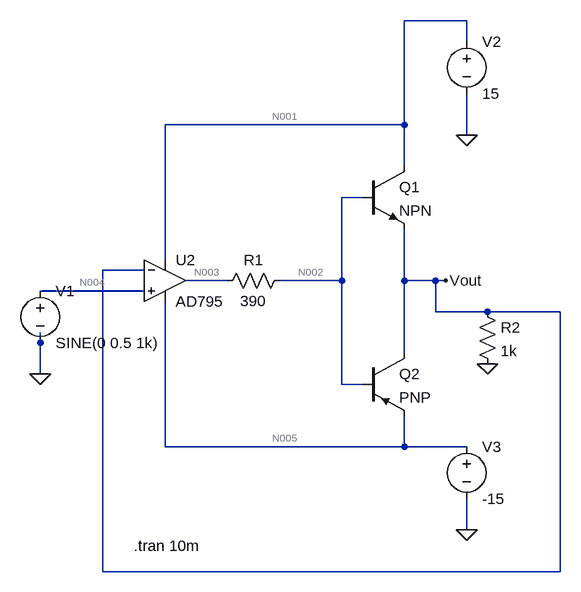
[diagram p0: schematic opamp based push pull amplifier circuit.asc]
opamp based push pull amplifier circuit.asc, the LTspice schematic file:
Version 4.1
SHEET 1 1332 692
WIRE 352 -160 256 -160
WIRE 352 -128 352 -160
WIRE 256 0 256 -160
WIRE 256 0 -112 0
WIRE 352 16 352 -48
WIRE 256 64 256 0
WIRE 192 112 160 112
WIRE -112 208 -112 0
WIRE -144 224 -208 224
WIRE -16 240 -80 240
WIRE 160 240 160 112
WIRE 160 240 64 240
WIRE 256 240 256 160
WIRE 304 240 256 240
WIRE 320 240 304 240
WIRE -144 256 -304 256
WIRE 304 288 304 240
WIRE 384 288 304 288
WIRE 496 288 384 288
WIRE -304 336 -304 320
WIRE 256 352 256 240
WIRE -304 384 -304 336
WIRE 160 400 160 240
WIRE 192 400 160 400
WIRE -112 496 -112 272
WIRE 256 496 256 448
WIRE 256 496 -112 496
WIRE 352 496 256 496
WIRE 352 624 352 576
WIRE -208 688 -208 224
WIRE 496 688 496 288
WIRE 496 688 -208 688
FLAG 352 16 0
FLAG 352 624 0
FLAG 320 240 Vout
FLAG -304 384 0
FLAG 384 368 0
SYMBOL npn 192 64 R0
SYMATTR InstName Q1
SYMBOL pnp 192 352 R0
SYMATTR InstName Q2
SYMBOL res 80 224 R90
WINDOW 0 0 56 VBottom 2
WINDOW 3 32 56 VTop 2
SYMATTR InstName R1
SYMATTR Value 390
SYMBOL voltage 352 -144 R0
WINDOW 123 0 0 Left 0
WINDOW 39 0 0 Left 0
SYMATTR InstName V2
SYMATTR Value 15
SYMBOL voltage 352 480 R0
WINDOW 123 0 0 Left 0
WINDOW 39 0 0 Left 0
SYMATTR InstName V3
SYMATTR Value -15
SYMBOL voltage -304 240 R0
WINDOW 123 0 0 Left 0
WINDOW 39 0 0 Left 0
SYMATTR InstName V1
SYMATTR Value SINE(0 0.5 1k)
SYMBOL OpAmps\\AD795 -112 176 R0
SYMATTR InstName U2
SYMBOL res 368 272 R0
SYMATTR InstName R2
SYMATTR Value 1k
TEXT -160 648 Left 2 !.tran 10m

The netlist it stands for:
* opamp based push pull amplifier circuit.asc
Q1 N001 N002 Vout 0 NPN
Q2 Vout N002 N005 0 PNP
R1 N002 N003 390
V2 N001 0 15
V3 N005 0 -15
V1 N004 0 SINE(0 0.5 1k)
X§U2 N004 Vout N001 N005 N003 AD795  ; pins In+ In- V+ V- OUT
R2 Vout 0 1k
.model NPN NPN
.model PNP PNP
.lib standard.bjt
.tran 10m
.lib ADI1.lib
.backanno
.end

* Results of the author's LTspice run, read from the files saved beside the schematic
* Operating Point, zero values left out:
*   V(n005) = -15 V
*   V(n001) = 15 V
*   Ic(Q1) = 15 pA
*   Ib(Q1) = -15 pA
*   I(V3) = 1.226 mA
*   Ib(Q2) = 15 pA
*   Ie(Q2) = -15 pA
*   I(V2) = -1.226 mA
*   Ix(u2:3) = 1.226 mA
*   Ix(u2:4) = -1.226 mA
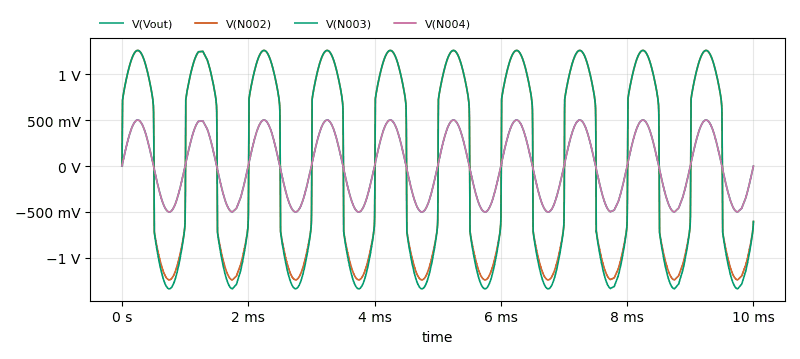
[diagram p1: Transient Analysis of opamp based push pull amplifier circuit.asc, plotted from the saved traces]
* Transient Analysis, 1 run:
*   V(Vout): min -500 mV, max 500 mV, average 230.8 µV, rms 353.1 mV, last -2.47 mV
*   V(N002): min -1.238 V, max 1.256 V, average 9.606 mV, rms 1.059 V, last -603.5 mV
*   V(N003): min -1.336 V, max 1.258 V, average -20.72 mV, rms 1.093 V, last -604 mV
*   V(N004): min -500 mV, max 500 mV, average 222.6 µV, rms 353.1 mV, last 0 V